# EAGLE design ardu_battle (EAGLE 5.06)
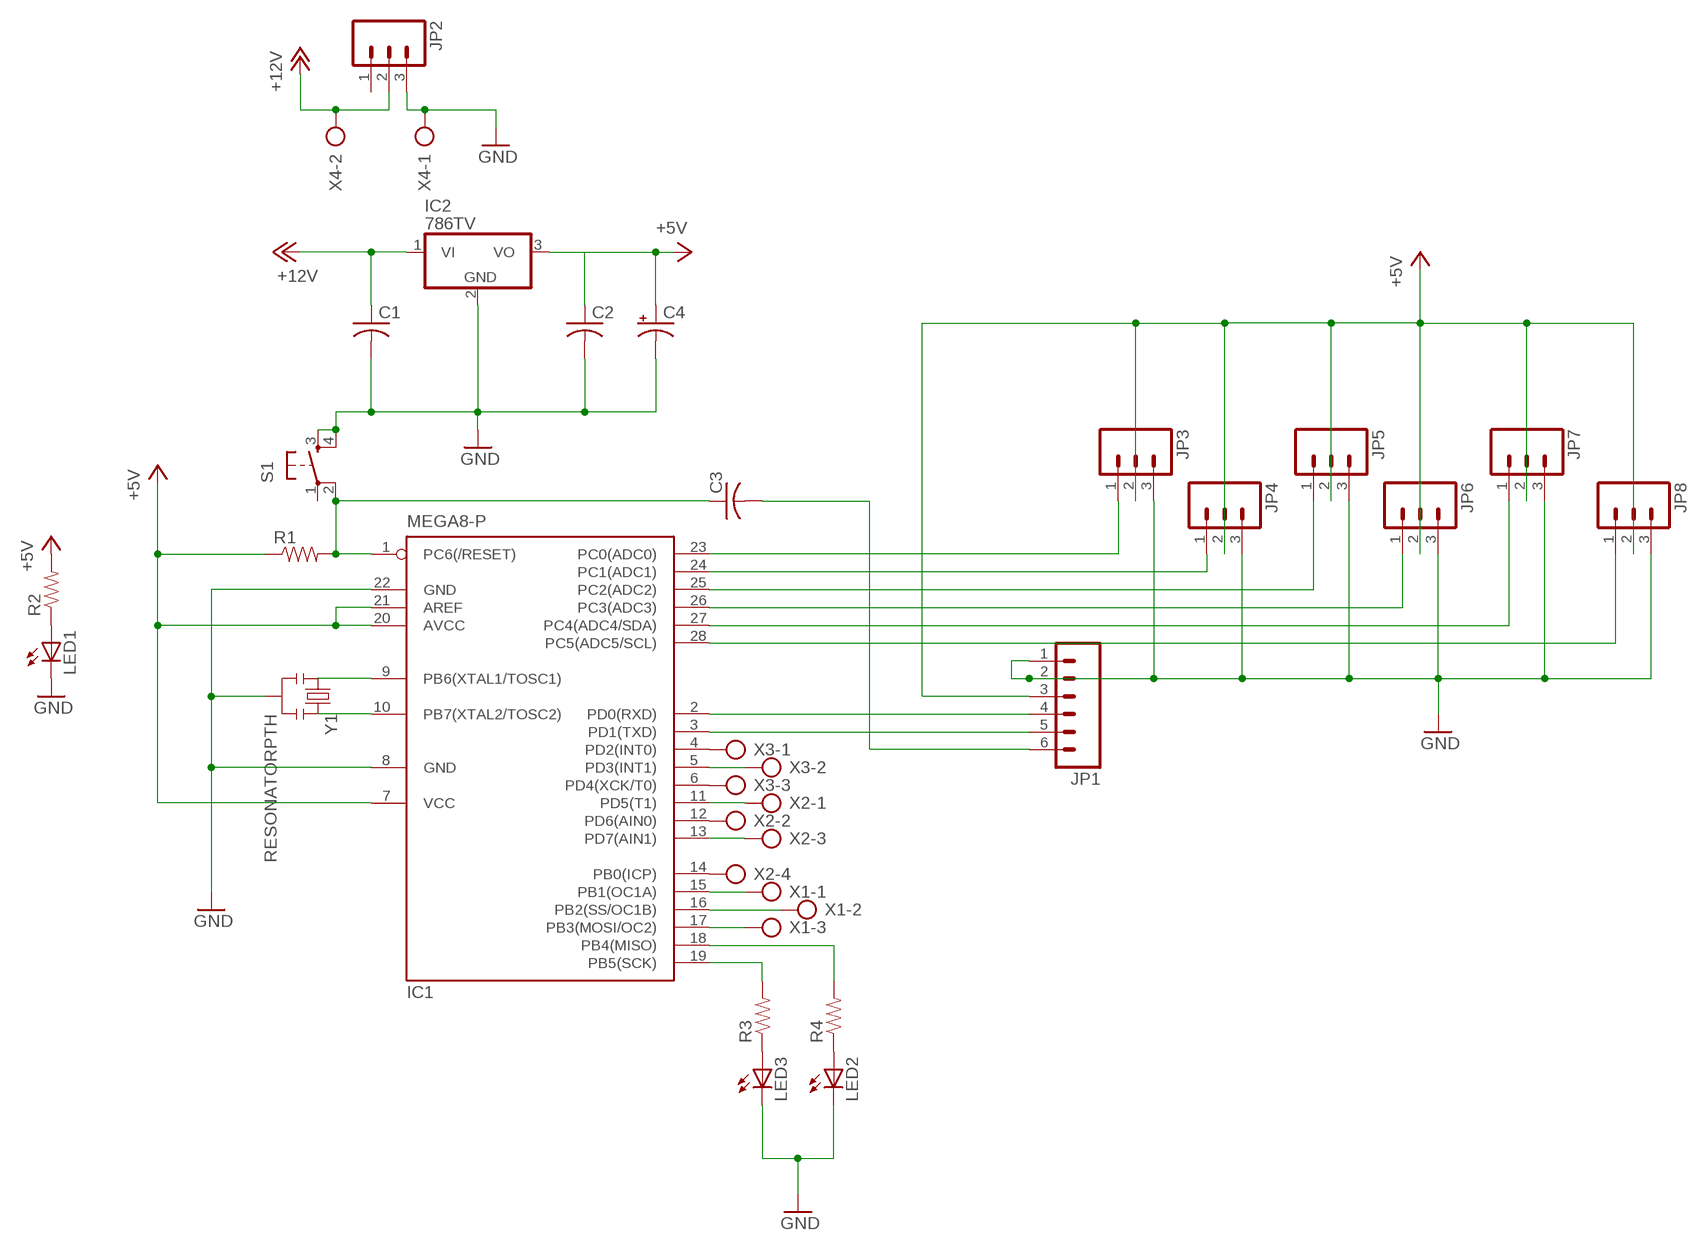
[diagram p0: schematic, sheet 1]

## Parts
C1  C-US025-030X050  [C025-030X050]
C2  C-US025-030X050  [C025-030X050]
C3  C-US075-032X103  [C075-032X103]
C4  CPOL-USE5-6  [E5-6]
IC1  MEGA8-P  [DIL28-3]
IC2  786TV  [TO220V]
JP1  M06SIP  [1X06]
JP2  M03PTH  [1X03]
JP3  M03PTH  [1X03]
JP4  M03PTH  [1X03]
JP5  M03PTH  [1X03]
JP6  M03PTH  [1X03]
JP7  M03PTH  [1X03]
JP8  M03PTH  [1X03]
LED1  LED3MM  [LED3MM]
LED2  LED3MM  [LED3MM]
LED3  LED3MM  [LED3MM]
R1  RESISTORPTH-1/6W  [1/6W-RES]
R2  RESISTORPTH-1/6W  [1/6W-RES]
R3  RESISTORPTH-1/6W  [1/6W-RES]
R4  RESISTORPTH-1/6W  [1/6W-RES]
S1  TAC_SWITCHPTH  [TACTILE-PTH]
X1  AK500/3  [AK500/3]
X2  AK500/4  [AK500/4]
X3  AK500/3  [AK500/3]
X4  AK500/2  [AK500/2]
Y1  RESONATORPTH  [RESONATOR-PTH]

## Nets
+5V: C2.1 C4.+ IC1.7(VCC) IC1.20(AVCC) IC1.21(AREF) IC2.3(VO) JP1.3 JP3.2 JP4.2 JP5.2 JP6.2 JP7.2 JP8.2 R1.1 R2.2
+12V: C1.1 IC2.1(VI) JP2.2 X4.2
GND: C1.2 C2.2 C4.- IC1.8(GND) IC1.22(GND) IC2.2(GND) JP1.1 JP1.2 JP2.3 JP3.3 JP4.3 JP5.3 JP6.3 JP7.3 JP8.3 LED1.K(C) LED2.K(C) LED3.K(C) S1.3 S1.4 X4.1 Y1.2
N$1: IC1.10(PB7(XTAL2/TOSC2)) Y1.3
N$2: IC1.9(PB6(XTAL1/TOSC1)) Y1.1
N$3: IC1.23(PC0(ADC0)) JP3.1
N$4: IC1.24(PC1(ADC1)) JP4.1
N$6: IC1.19(PB5(SCK)) R3.2
N$7: IC1.18(PB4(MISO)) R4.2
N$8: IC1.17(PB3(MOSI/OC2)) X1.3
N$9: IC1.25(PC2(ADC2)) JP5.1
N$10: IC1.26(PC3(ADC3)) JP6.1
N$11: IC1.27(PC4(ADC4/SDA)) JP7.1
N$12: IC1.28(PC5(ADC5/SCL)) JP8.1
N$13: IC1.16(PB2(SS/OC1B)) X1.2
N$14: IC1.15(PB1(OC1A)) X1.1
N$15: IC1.6(PD4(XCK/T0)) X3.3
N$16: IC1.4(PD2(INT0)) X3.1
N$17: IC1.12(PD6(AIN0)) X2.2
N$18: IC1.14(PB0(ICP)) X2.4
N$19: IC1.2(PD0(RXD)) JP1.4
N$20: IC1.3(PD1(TXD)) JP1.5
N$21: IC1.11(PD5(T1)) X2.1
N$22: IC1.13(PD7(AIN1)) X2.3
N$23: C3.2 JP1.6
N$24: LED1.A R2.1
N$25: LED3.A R3.1
N$26: LED2.A R4.1
N$29: C3.1 IC1.1(PC6(/RESET)) R1.2 S1.2
N$30: IC1.5(PD3(INT1)) X3.2
Unconnected: JP2.1 S1.1

## Library data of the parts
C1-C3 = rcl:C-US: CAPACITOR, American symbol
C4 = rcl:CPOL-US: POLARIZED CAPACITOR, American symbol
IC1 = atmel:MEGA8-P: MICROCONTROLLER 8 Kbytes FLASH, 1 kbytes SRAM, 512 bytes EEPROM, USART, 4-channel 10 bit ADC, 2-channel 8 bit ADC Pin compatible with Atmega48, ATMega88, ATMega168 Source: avr.lbr
IC2 = linear:78*: Positive VOLTAGE REGULATOR Source: http://cache.national.com/ds/LM/LM78L05.pdf http://www.fairchildsemi.com/ds/LM/LM7805.pdf
JP1 = SparkFun:M06: Header 6 Standard 6-pin 0.1" header. Use with straight break away headers (SKU : PRT-00116), right angle break away headers (PRT-00553), swiss pins (PRT-00743), machine pins (PRT-00117), and female headers (PRT-00115). Molex polarized connector foot print use with SKU : PRT-08094 with associated crimp pins and housings. NOTES ON THE VARIANTS LOCK and LOCK_LONGPADS... This footprint was designed to help hold the alignment of a through-hole component (i.e. 6-pin header) while soldering it into place. You may notice that each hole has been shifted either up or down by 0.005 of an inch from it's more standard position (which is a perfectly straight line). This slight alteration caused the pins (the squares in the middle) to touch the edges of the holes. Because they are alternating, it causes a "brace" to hold the component in place. 0.005 has proven to be the perfect amount of "off-center" position when using our standard breakaway headers. Although looks a little odd when you look at the bare footprint, once you have a header in there, the alteration is very hard to notice. Also, if you push a header all the way into place, it is covered up entirely on the bottom side. This idea of altering the position of holes to aid alignment will be further integrated into the Sparkfun Library for other footprints. It can help hold any component with 3 or more connection pins.
JP2-JP8 = SparkFun:M03: Header 3 Standard 3-pin 0.1" header. Use with straight break away headers (SKU : PRT-00116), right angle break away headers (PRT-00553), swiss pins (PRT-00743), machine pins (PRT-00117), and female headers (PRT-00115). Molex polarized connector foot print use with SKU : PRT-08232 with associated crimp pins and housings.
LED1-LED3 = SparkFun:LED: LEDs Standard schematic elements and footprints for 5mm, 3mm, 1206, and 0603 sized LEDs. 5mm - Spark Fun Electronics SKU : COM-00529 (and others)
R1-R4 = SparkFun:RESISTOR: Resistor Basic schematic elements and footprints for 0603, 1206, and PTH 1/10th watt (small) resistors.
S1 = SparkFun:TAC_SWITCH: Momentary Switch Button commonly used for reset or general input. Spark Fun Electronics SKU : COM-00097
X1 X3 = con-ptr500:AK500/3: CONNECTOR
X2 = con-ptr500:AK500/4: CONNECTOR
X4 = con-ptr500:AK500/2: CONNECTOR
Y1 = SparkFun:RESONATOR: Resonator Small SMD resonator. This is the itty bitty 10/20MHz resonators with built in caps. CSTCE10M0G55 and CSTCE20M0V53. Footprint has been reviewed closely but hasn't been tested yet.

## Board
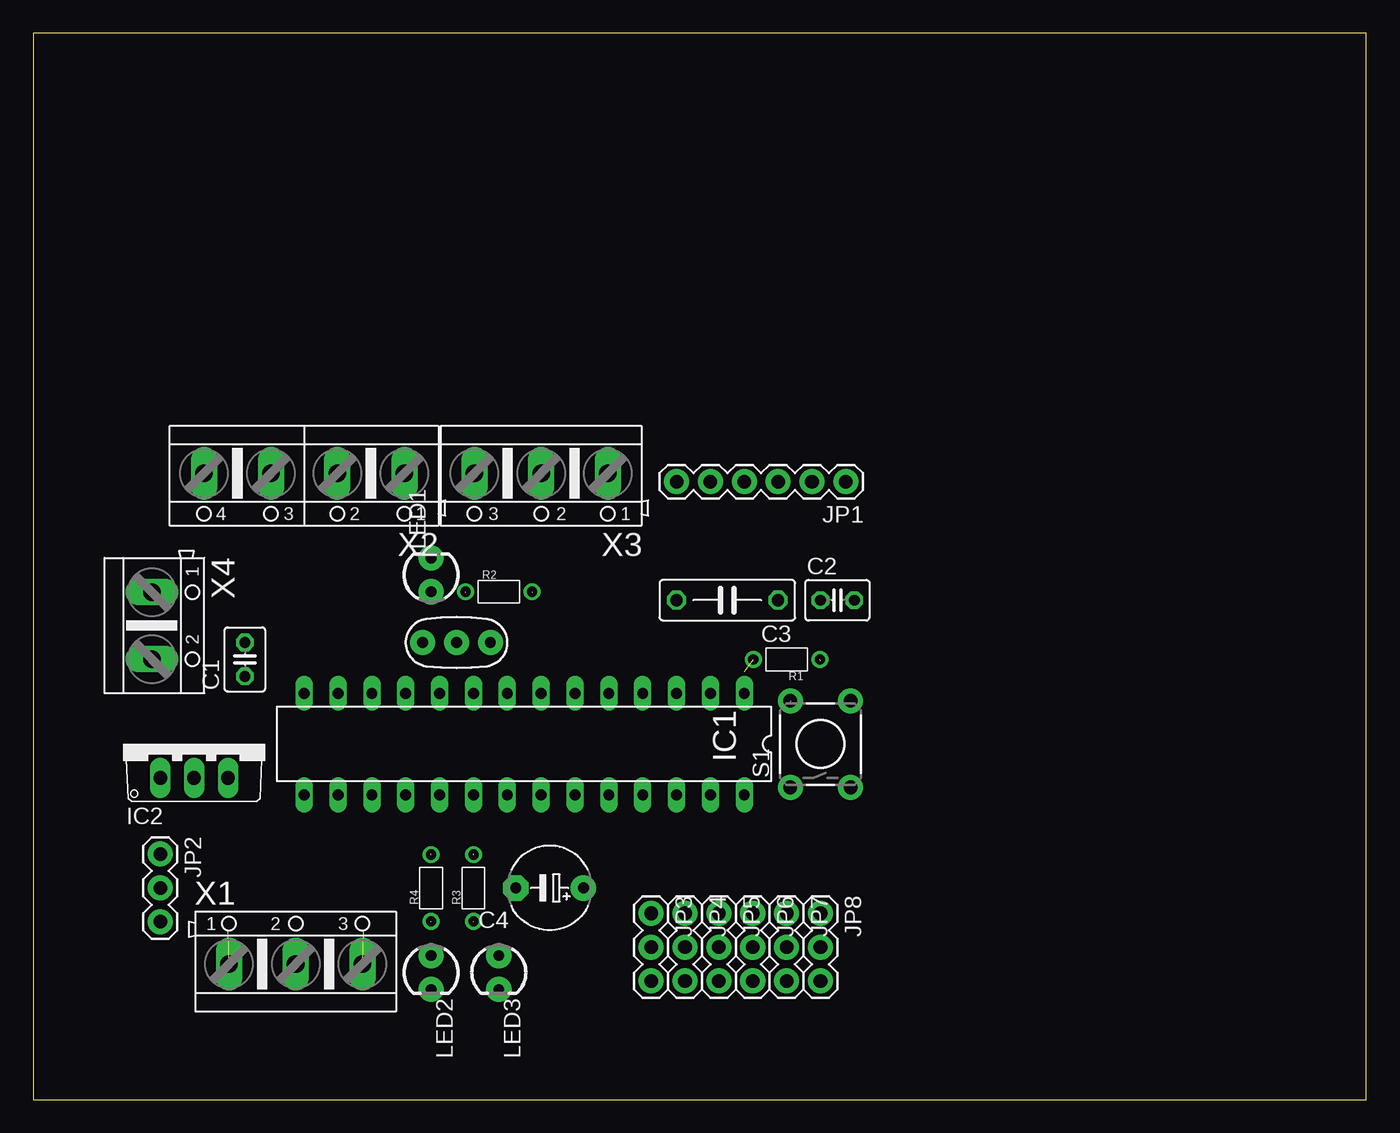
[diagram p1: board, top side]
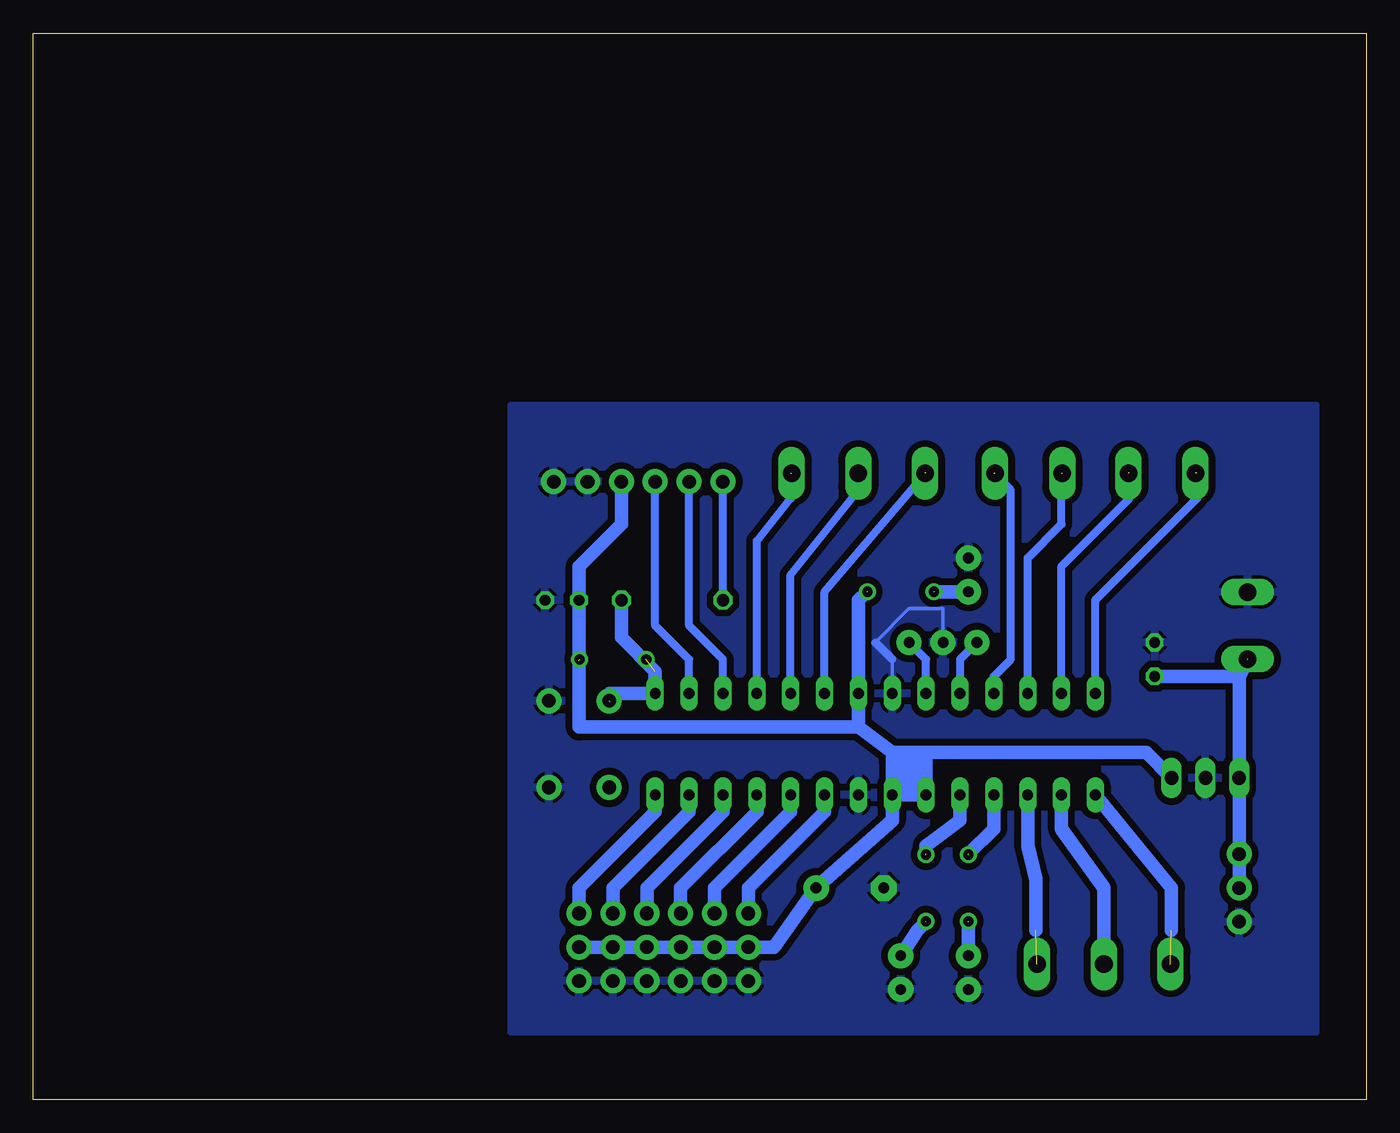
[diagram p2: board, bottom side, seen from below]

Size 100 x 80 mm. Coordinates in mm from the lower left corner, seen from the top.
Outline: 0,0 100,0 100,80 0,80 0,0
Copper layers (1*16): Top 0.035mm / dielectric 1.5mm / Bottom 0.035mm
Design rules "default *": minimum track width 10mil, minimum drill 24mil, track to track 20mil, track to pad 20mil, pad to pad 8mil, via to via 8mil, smd to smd 8mil, copper to edge 40mil, drill to drill 8mil, minimum pad ring 10mil, minimum via ring 8mil, stop-mask expansion 4mil, vias tented up to drill 0mil, thermal gap 10mil

### Footprints (pad centres in the part's own frame; a part is rotated, then mirrored left to right if it is on the bottom)
C025-030X050 = drill 0.813 octagon: 1 -1.27,0; 2 1.27,0
C075-032X103 = drill 0.914 octagon: 1 -3.81,0; 2 3.81,0
E5-6 = drill 0.813 pad 1.905 round: + -2.54,0 | drill 0.813 pad 1.905 octagon: - 2.54,0
DIL28-3 = drill 0.813 long: 1 -16.51,-3.81; 2 -13.97,-3.81; 3 -11.43,-3.81; 4 -8.89,-3.81; 5 -6.35,-3.81; 6 -3.81,-3.81; 7 -1.27,-3.81; 8 1.27,-3.81; 9 3.81,-3.81; 10 6.35,-3.81; 11 8.89,-3.81; 12 11.43,-3.81; 13 13.97,-3.81; 14 16.51,-3.81; 15 16.51,3.81; 16 13.97,3.81; 17 11.43,3.81; 18 8.89,3.81; 19 6.35,3.81; 20 3.81,3.81; 21 1.27,3.81; 22 -1.27,3.81; 23 -3.81,3.81; 24 -6.35,3.81; 25 -8.89,3.81; 26 -11.43,3.81; 27 -13.97,3.81; 28 -16.51,3.81
TO220V = drill 1.016 long: 1 -2.54,-2.54; 2 0,-2.54; 3 2.54,-2.54
1X06 = drill 1.016 pad 1.88 round: 1 0,0; 2 2.54,0; 3 5.08,0; 4 7.62,0; 5 10.16,0; 6 12.7,0
1X03 = drill 1.016 pad 1.88 round: 1 0,0; 2 2.54,0; 3 5.08,0
LED3MM = drill 0.813 pad 1.88 round: A -1.27,0; K 1.27,0
1/6W-RES = drill 0.762 round: 1 -2.5,0; 2 2.5,0
TACTILE-PTH = drill 1.016 pad 1.88 round: 1 -3.251,2.261; 2 3.251,2.261; 3 -3.251,-2.261; 4 3.251,-2.261
AK500/3 = drill 1.321 long: 1 -5.004,0; 2 0,0; 3 5.004,0
AK500/4 = drill 1.321 long: 1 -7.518,0; 2 -2.489,0; 3 2.489,0; 4 7.518,0
AK500/2 = drill 1.321 long: 1 -2.515,0; 2 2.515,0
RESONATOR-PTH = drill 0.8 pad 1.88 round: 1 -2.54,0; 2 0,0; 3 2.54,0

### Placement (x,y rotation side)
C1  15.88,33.02 90 top
C2  60.33,37.47 0 top
C3  52.07,37.47 180 top
C4  38.73,15.88 180 top
IC1  36.83,26.67 180 top
IC2  12.06,26.67 0 top
JP1  60.96,46.35 180 top
JP2  9.53,18.41 270 top
JP3  46.35,13.97 270 top
JP4  48.9,13.97 270 top
JP5  51.44,13.97 270 top
JP6  53.98,13.97 270 top
JP7  56.52,13.97 270 top
JP8  59.05,13.97 270 top
LED1  29.84,39.37 90 top
LED2  29.84,9.53 270 top
LED3  34.92,9.53 270 top
R1  56.52,33.02 180 top
R2  34.92,38.1 0 top
R3  33.02,15.88 90 top
R4  29.84,15.88 90 top
S1  59.05,26.67 90 top
X1  19.68,10.16 0 top
X2  20.32,46.99 180 top
X3  38.1,46.99 180 top
X4  8.89,35.56 270 top
Y1  31.75,34.29 180 top

### Tracks (layer width: path | path; a pad name or v marks a point on that pad's centre or on a via)
+5V  (2 unrouted)
  Bottom 0.254: IC1.21 IC1.20
  Bottom 1.016: 35.56,26.04 38.1,27.94 | 38.1,27.94 IC1.7 38.1,37.47 37.47,38.1 | JP8.2 JP7.2 JP6.2 JP5.2 JP4.2 JP3.2 44.45,11.43 C4.+ 35.56,20.95 IC1.21 | IC2.3 16.51,26.04 33.02,26.04 | 33.02,26.04 35.56,26.04 | 35.56,26.04 33.02,24.77 33.02,26.04 | 33.02,26.04 33.66,26.04 33.02,25.4 33.02,23.5 35.56,23.5 35.56,25.4 | 35.56,25.4 33.66,25.4 33.66,24.13 34.92,24.13 34.92,26.04 35.56,26.04 | 35.56,26.04 35.56,25.4 | 35.56,25.4 34.92,24.77 34.29,24.77 33.02,26.04 | 33.02,26.04 IC1.21 | IC1.21 IC1.20 | 38.1,27.94 59.05,27.94 59.05,32.89 C2.1 59.05,40.01 55.88,43.18 JP1.3
+12V  (1 unrouted)
  Bottom 1.016: 9.53,31.75 IC2.1 JP2.2 | 9.53,31.75 9.53,33.02 8.89,33.02 9.53,31.75 | 9.53,31.75 C1.1
GND
  Bottom 0.254: 36.83,34.29 34.29,36.83 31.75,36.83 Y1.2 | 35.56,33.02 IC1.8
  Bottom 0.61: 36.83,34.29 35.56,33.02
  pour Bottom: 3.81,52.07 3.81,5.08 64.14,5.08 64.14,52.07
N$1
  Bottom 0.61: IC1.10 30.48,33.02 Y1.3
N$2
  Bottom 0.61: IC1.9 33.02,33.02 Y1.1
N$3
  Bottom 1.016: JP3.1 46.35,15.88 40.64,21.59 IC1.23
N$4
  Bottom 1.016: JP4.1 48.9,15.88 43.18,21.59 IC1.24
N$5
  Bottom 0.406: 53.98,33.02 53.34,32.38 53.34,30.35
N$6  (1 unrouted)
  Bottom 1.016: 33.02,18.41 33.02,19.05 30.48,20.95 IC1.19
N$7  (1 unrouted)
  Bottom 1.016: 29.84,18.41 27.94,20.32 IC1.18
N$8  (1 unrouted)
  Bottom 1.016: 24.77,12.7 24.77,16.51 25.4,19.05 IC1.17
N$9
  Bottom 1.016: JP5.1 51.44,15.88 45.72,21.59 IC1.25
N$10
  Bottom 1.016: JP6.1 53.98,15.88 48.26,21.59 IC1.26
N$11
  Bottom 1.016: JP7.1 56.52,15.88 50.8,21.59 IC1.27
N$12
  Bottom 1.016: JP8.1 59.05,15.88 53.34,21.59 IC1.28
N$13
  Bottom 1.016: X1.2 19.68,15.88 22.86,20.32 IC1.16
N$14  (1 unrouted)
  Bottom 1.016: 14.61,12.7 14.61,15.88 IC1.15
N$15  (1 unrouted)
  Bottom 0.61: 33.02,46.99 40.64,38.1 IC1.6
N$16  (1 unrouted)
  Bottom 0.61: IC1.4 45.72,41.91 43.18,45.09 43.18,46.99
N$17  (1 unrouted)
  Bottom 0.61: IC1.12 25.4,40.64 22.86,43.18 22.86,46.99
N$18  (1 unrouted)
  Bottom 0.61: 12.7,46.99 12.7,45.09 20.32,37.47 IC1.14
N$19
  Bottom 0.61: JP1.4 53.34,35.56 50.8,33.02 IC1.2
N$20
  Bottom 0.61: IC1.3 48.26,33.02 50.8,35.56 JP1.5
N$21  (1 unrouted)
  Bottom 0.61: 27.94,46.99 26.67,45.72 26.67,33.02 27.94,31.75 IC1.11
N$22  (1 unrouted)
  Bottom 0.61: 17.78,46.99 17.78,45.09 22.86,40.01 IC1.13
N$23
  Bottom 0.61: C3.2 JP1.6
N$24  (1 unrouted)
  Bottom 1.016: LED1.A 32.38,38.1
N$25  (1 unrouted)
  Bottom 1.016: LED3.A 33.66,12.7 33.02,13.34
N$26  (1 unrouted)
  Bottom 1.016: LED2.A 29.84,13.34
N$29  (2 unrouted)
  Bottom 1.016: C3.1 55.88,34.67 53.34,32.13 IC1.1 56.77,30.48 56.77,29.84
N$30
  Bottom 0.61: IC1.5 43.18,39.37 38.1,45.72 X3.2